# Altium schematic sheet CAN Bus.SchDoc
size A4; SheetNumber: 5; SheetTotal: 9
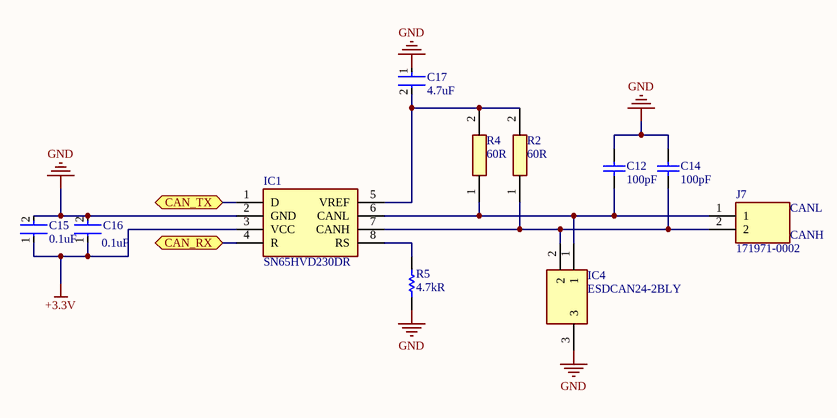
[diagram p0: CAN Bus.SchDoc]

## Parts
C12  100pF  [CAPC1608X90X35NL10T15]
C14  100pF  [CAPC1608X90X35NL10T15]
C15  0.1uF  [FP-GRM15-MFG]
C16  0.1uF  [FP-GRM15-MFG]
C17  4.7uF  [FP-GRM155-0_1-IPC_B]
IC1  SN65HVD230DR  [SOT127P600X175-8N]
IC4  ESDCAN24-2BLY  [SOT105P255X150-3N]
J7  171971-0002  [SHDR2W65P0X254_1X2_738X510X1216P]
R2  60R  [RESC3216X60N]
R4  60R  [RESC3216X60N]
R5  4.7kR  [RESC3216X60X45ML15T20]

## Ports
CAN_RX (bidir), CAN_TX (bidir)

## Nets
+3.3V: C15.1 C16.1 IC1.3(VCC)
GND: C12.2 C14.2 C15.2 C16.2 C17.1 IC1.2(GND) IC4.3 R5.1
CAN_RX: IC1.4(R) ; port CAN_RX
CAN_TX: IC1.1(D) ; port CAN_TX
NetC12_1: C12.1 IC1.6(CANL) IC4.1 J7.1 R4.1
NetC14_1: C14.1 IC1.7(CANH) IC4.2 J7.2 R2.1
NetC17_2: C17.2 IC1.5(VREF) R2.2 R4.2
NetIC1_8: IC1.8(RS) R5.2

## Notes on the sheet
- CANL
- CANH

## Library data of the parts
C12 C14 = CMP-2006-02595-1: Part Number: GRM1885C1H101JA01D; Manufacturer: Murata
C15 C16 = CMP-2100-03641-2: CAP CER 0.1UF 16V X7R 0402; Manufacturer Part Number: GRM155R71C104KA88D; Manufacturer: Murata; Standoff Height: 0mm; Tolerance: 10%; Voltage Rating: 16Vdc; Material: Ceramic; Capacitance: 0.10μF; Value: 0.10μF; RoHS: TRUE; Temperature Characteristic: X7R; Octopart: https://octopart.com/grm155r71c104ka88d-murata-196880; Digikey Description: CAP CER 0.1UF 16V X7R 0402; Device Class L3: Ceramic Capacitors; Height: 0.55mm; ComponentLink2Description: Datasheet; Temperature Range Low: -55°C; Ipc Land Pattern Name: CAPC10050X219; ComponentLink2URL: https://search.murata.co.jp/Ceramy/image/img/A01X/G101/ENG/GRM155R71H471KA01-01A.pdf; Device Class L1: Passive Components; Lead Free: yes; Category: Cap; Package: GRM15; Temperature: -55°C to +125°C; Device Class L2: Capacitors; Temperature Range High: +125°C; Mouser Description: 0402 0.1 uF 16V ±10 % Tolerance X7R SMT Multilayer Ceramic Capacitor
C17 = CMP-2008-04549-2: Chip Multilayer Ceramic Capacitors for General Purpose, 0402, 4.7uF, X5R, 15%, 20%, 6.3V; Height: 0.5mm; Weight: 0.000212oz; Length: 1mm; Case Code (Metric): 1005; Packaging: Tape and Reel; Termination: SMD/SMT; Dielectric: X5R; Depth: 0.5mm; Case Code (Imperial): 0402; Min Operating Temperature: -55°C; Case/Package: 0402; Voltage: 6.3V; Width: 0.02inch; Capacitance: 4.7uF; Lead Free: Lead Free; Thickness: 0.022inch; Contact Plating: Tin; REACH SVHC: No SVHC; Package Quantity: 10000; Tolerance: 20%; Voltage Rating (DC): 6.3V; Voltage Rating: 6.3V; Mount: Surface Mount; Max Operating Temperature: 85°C
IC1 = SN65HVD230DR: Integrated Circuit; Manufacturer_Name: Texas Instruments; Datasheet Link: http://www.ti.com/lit/gpn/sn65hvd230; Height: 1.75mm; Mouser2 Part Number: 595-SN65HVD230DR; Mouser2 Price/Stock: https://www.mouser.com/Search/Refine.aspx?Keyword=595-SN65HVD230DR; Manufacturer_Part_Number: SN65HVD230DR
IC4 = ESDCAN24-2BLY: Integrated Circuit; Manufacturer_Name: STMicroelectronics; Datasheet Link: https://componentsearchengine.com//ESDCAN24-2BLY.pdf; Height: 1.5mm; Mouser2 Part Number: 511-ESDCAN24-2BLY; Mouser2 Price/Stock: https://www.mouser.com/Search/Refine.aspx?Keyword=511-ESDCAN24-2BLY; Manufacturer_Part_Number: ESDCAN24-2BLY
J7 = 171971-0002: Connector; Manufacturer_Name: Molex; Datasheet Link: https://componentsearchengine.com//171971-0002.pdf; Height: 12.16mm; Mouser2 Part Number: 538-171971-0002; Mouser2 Price/Stock: https://www.mouser.com/Search/Refine.aspx?Keyword=538-171971-0002; Manufacturer_Part_Number: 171971-0002
R2 R4 = CRCW120660R0KNEAIF: Resistor; Manufacturer_Name: Vishay; Datasheet Link: http://componentsearchengine.com/Datasheets/1/CRCW120660R0KNEAIF.pdf; Height: 0.6mm; Manufacturer_Part_Number: CRCW120660R0KNEAIF
R5 = CMP-2100-03618-1: Chip Resistor, 4.7 KOhm, +/- 1%, 0.25 W, -55 to 155 degC, 1206 (3216 Metric), RoHS, Tape and Reel; Manufacturer: Vishay Semiconductor; Power Rating: 250mW; Voltage Rating: 200V; Temperature Coefficient: 100ppm/degreesC; Package Quantity: 10; Composition: ThickFilm; REACH SVHC: Unknown; Mount: SurfaceMount; Max Operating Temperature: 155degC; Length: 3.2mm; Number of Terminations: 2; Case Code (Metric): 3216; Military Standard: Not; Width: 1.6mm; Datasheet Version: 41061.0; Max Power Dissipation: 250mW; Datasheet URL: http://www.vishay.com/docs/20035/dcrcwe3.pdf; Contact Plating: Tin; Case/Package: 1206; Height: 0.55mm; Package Reference: 1206.0; Lead Free: LeadFree; Weight: 0.000353oz; Package Description: 2-Pin Surface Mount Device, Body 3.15 x 1.6 mm; Min Operating Temperature: -55degC; Resistance: 4.7KOhm; Packaging: TapeandReel; Depth: 1.6mm; Tolerance: 1%; RoHSCompliant: true; Termination: SMD/SMT; Case Code (Imperial): 1206; Voltage Rating (DC): 200V; Radiation Hardening: No; Manufacturer URL: http://www.vishay.com/